# Altium schematic sheet [3] STM32F103 Debugger.SchDoc
size A3; Scale: 1:1; ENG_APP_DATE: --/--/--; DSN_APP_DATE: --/--/--; CHK_APP_DATE: --/--/--; Author: Vishal Y. Bajaj; SheetNumber: 3; SheetTotal: 11; Template: A3
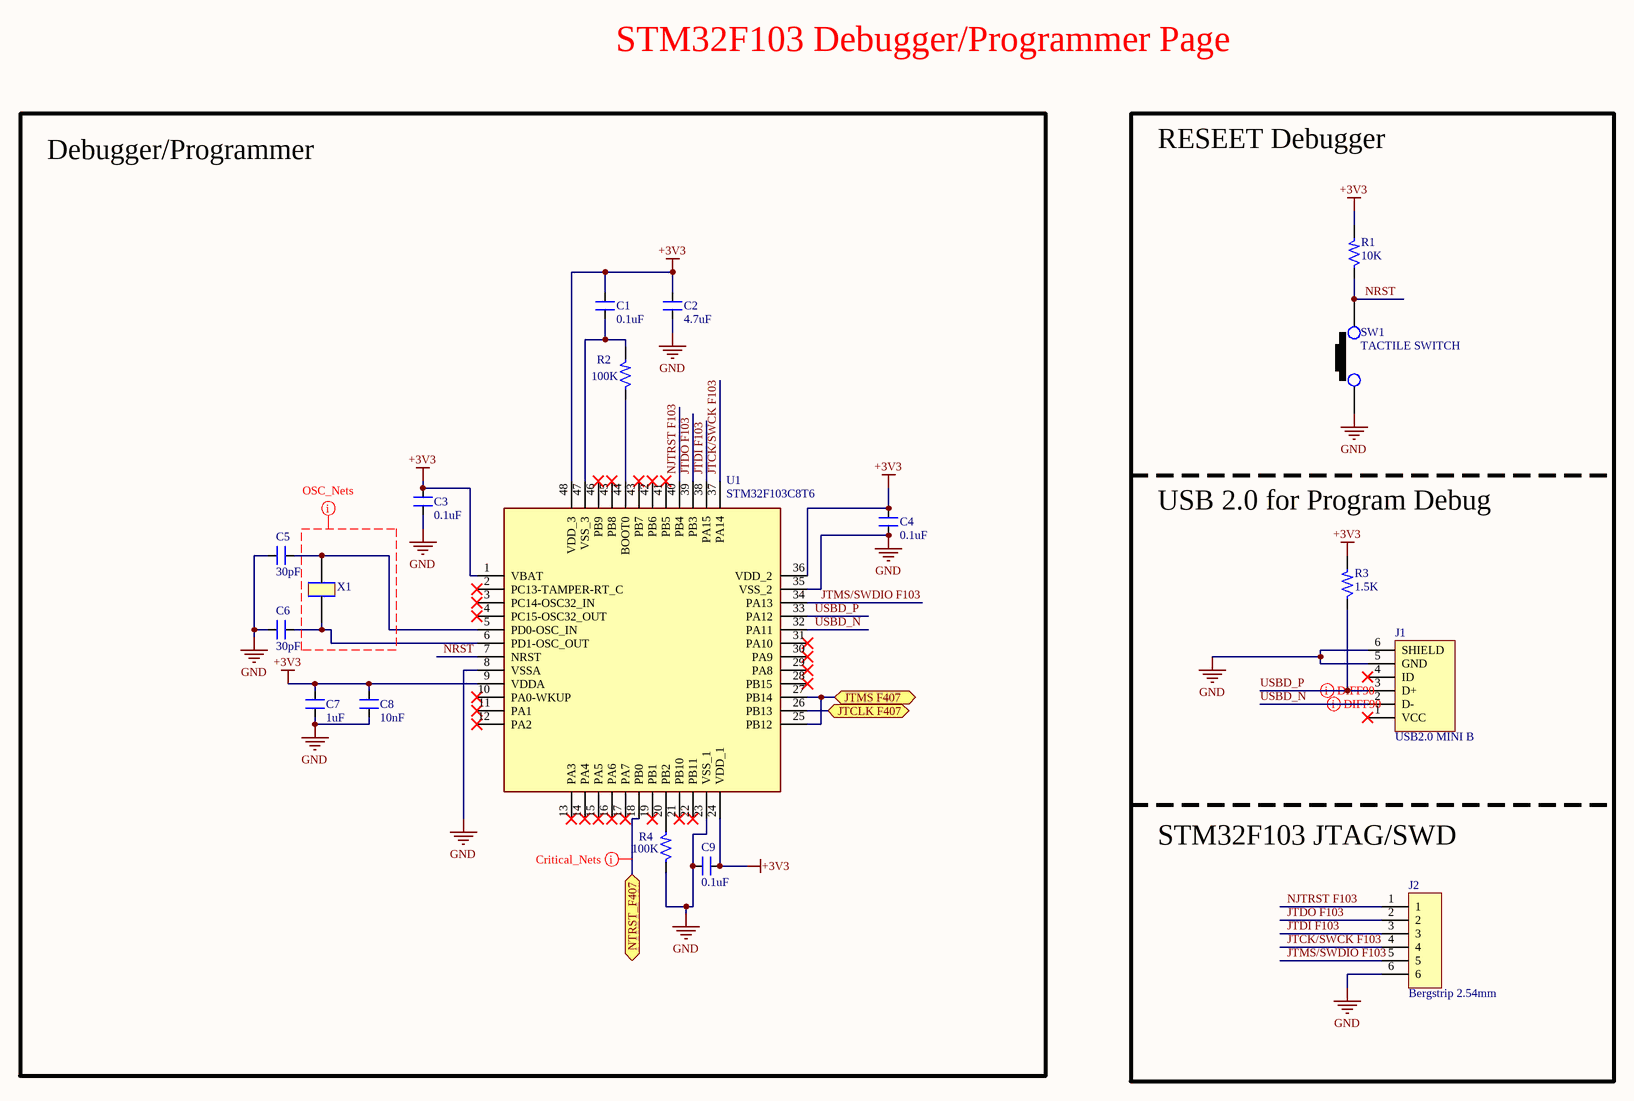
[diagram p0: [3] STM32F103 Debugger.SchDoc]

## Parts
C1  0.1uF  [CAP_0805]
C2  4.7uF  [CAP_0805]
C3  0.1uF  [CAP_0805]
C4  0.1uF  [CAP_0805]
C5  30pF  [CAP_0805]
C6  30pF  [CAP_0805]
C7  1uF  [CAP_0805]
C8  10nF  [CAP_0805]
C9  0.1uF  [CAP_0805]
J1  USB2.0 MINI B  [CON_690-005-299-043]
J2  Bergstrip 2.54mm  [CON6_100_59D78_TH_ST]
R1  10K  [RES_0603]
R2  100K  [RES_0603]
R3  1.5K  [RES_0805]
R4  100K  [RES_0603]
SW1  TACTILE SWITCH  [SW_342_SMD]
U1  STM32F103C8T6  [LQFP-48_19.6_393_58X11_SMD]
X1  (no value)  [XTAL_314_240X47_SMD]

## Blocks framed on the sheet
Debugger/Programmer: C1-C9 R2 R4 U1 X1

## Ports
JTCLK F407 (bidir), JTMS F407 (bidir), NTRST_F407 (bidir)

## Nets
+3V3: C1.2 C2.1 C3.2 C4.2 C7.2 C8.2 C9.1 R1.2 R3.2 U1.1(VBAT) U1.9(VDDA) U1.24(VDD_1) U1.36(VDD_2) U1.48(VDD_3)
GND: C2.2 C3.1 C4.1 C5.2 C6.2 C7.1 C8.1 C9.2 J1.5(GND) J1.6(SHIELD) J2.6 R4.1 SW1.1 U1.8(VSSA) U1.23(VSS_1) U1.35(VSS_2)
JTCK/SWCK F103: J2.4 U1.37(PA14)
JTCLK F407: U1.26(PB13) ; port JTCLK F407
JTDI F103: J2.3 U1.38(PA15)
JTDO F103: J2.2 U1.39(PB3)
JTMS F407: U1.25(PB12) U1.27(PB14) ; port JTMS F407
JTMS/SWDIO F103: J2.5 U1.34(PA13)
NJTRST F103: J2.1 U1.40(PB4)
NRST: R1.1 SW1.2 U1.7(NRST)
NTRST_F407: U1.18(PB0) ; port NTRST_F407
USBD_N: J1.2(D-) U1.32(PA11)
USBD_P: J1.3(D+) R3.1 U1.33(PA12)
NetC1_1: C1.1 R2.2 U1.47(VSS_3)
NetC5_1: C5.1 U1.5(PD0-OSC_IN) X1.2
NetC6_1: C6.1 U1.6(PD1-OSC_OUT) X1.1
NetR2_1: R2.1 U1.44(BOOT0)
NetR4_2: R4.2 U1.20(PB2)

Not connected (* = marked no-connect by the designer): J1 1(VCC)* 4(ID)*; U1 2(PC13-TAMPER-RT_C)* 3(PC14-OSC32_IN)* 4(PC15-OSC32_OUT)* 10(PA0-WKUP)* 11(PA1)* 12(PA2)* 13(PA3)* 14(PA4)* 15(PA5)* 16(PA6)* 17(PA7)* 19(PB1)* 21(PB10)* 22(PB11)* 28(PB15)* 29(PA8)* 30(PA9)* 31(PA10)* 41(PB5)* 42(PB6)* 43(PB7)* 45(PB8)* 46(PB9)*

## Layout directives
differential pair; differential pair class DIFF90: USBD_N, USBD_P
net class Critical_nets: NTRST_F407
net class OSC_Nets: (no net found under the mark)

## Notes on the sheet
- STM32F103 Debugger/Programmer Page
- RESEET Debugger
- (near R3) USB 2.0 for Program Debug
- (near J2) STM32F103 JTAG/SWD
- Project:
- Page Contents:
- Variant:
- Author:
- Scale:
- Template:
- Project Code:
- Sheet
- Date:
- of
- This documant is a copyright of Vishal Y. Bajaj and shall not be revealed, produced, copied in whole or in part nor used for any purpose
  other than submitted.

## Library data of the parts
C1 C3 C4 C9 = CAP_0.1uF-50V-10%-0805: 0.1µF ±10% 50V Ceramic Capacitor X7R 0805 (2012 Metric) /; Manufacturer: Samsung; Manufacturer Part Number: CL21B104KBCNNNC; Alternate Part Number-1: NA; Case/Package: 0805; Supplier-1: SIRICOM; Supplier Part Number-1: 0805B104K500CT
C2 = CAP_4.7uF-50V-10%-0805: 4.7µF ±10% 50V Ceramic Capacitor X5R 0805 (2012 Metric) /; Manufacturer: Yageo; Manufacturer Part Number: GRM21BR61H475KE51L; Alternate Part Number-1: NA; Case/Package: 0805; Supplier-1: SIRICOM; Supplier Part Number-1: CL21A475KBQNNNE
C5 C6 = CAP_30pF-50V-10%-0805: ±10% 50V Ceramic Capacitor C0G, NP0 0805 (2012 Metric) /; Manufacturer Part Number: C0805C300K5GAC7800; Manufacturer: KEMET; Alternate Part Number: NA; Case/Package: 0805; Supplier-1: Digikey; Supplier Part Number-1: 399-17443-1-ND - Cut Tape (CT)
C7 = CAP_1uF-50V-5%-0805: 1µF ±5% 50V Ceramic Capacitor X7R 0805 (2012 Metric) /; Manufacturer: Samsung; Manufacturer Part Number: CC0805JKX7R9BB105; Alternate Part Number-1: 0805F105M500NT; Case/Package: 0805; Supplier-1: SIRICOM; Supplier Part Number-1: CL21B105KBFNNNE
C8 = CAP_10nF-50V-10%-0805: 10000pF ±10% 50V Ceramic Capacitor X7R 0805 (2012 Metric) /; Manufacturer: Samsung; Manufacturer Part Number: C0805C103K5RECAUTO; Alternate Part Number-1: GRM2195C1H103JA01D; Case/Package: 0805; Supplier-1: SIRICOM; Supplier Part Number-1: 0805B103K500CT
J1 = CON_USB2.0-MINIB-SMD: USB - mini B USB 2.0 Receptacle Connector 5 Position Surface Mount, Right Angle; Manufacturer: EDAC; Manufacturer Part Number: 690-005-299-043; Alternate Part Number-1: NA; Case/Package: USB-MINI-B; Supplier-1: LCSC; Supplier Part Number-1: C105424
J2 = CON-BS-SKT_6X1-100-ST-TH: 6 Pins, 1 Row 2.54mm Pitch, Straight bergstrip, Female; Manufacturer: Molex; Alternate Part Number-1: NA; Manufacturer Part Number: 22-10-2061; Case/Package: TH-CON; Supplier-1: SP ROAD; Supplier Part Number-1: NA
R1 = RES_10K-0.1W-1%-0603: 10 kOhms ±1% 0.1W, 1/10W Chip Resistor 0603 (1608 Metric) Automotive AEC-Q200 Thick Film /; Manufacturer: Walsin; Manufacturer Part Number: WR06X1002FTL; Alternate Part Number-1: 0603WAJ0103T5E; Case/Package: 0603; Supplier-1: SIRICOM; Supplier Part Number-1: WR06X1002FTL
R2 R4 = RES_100K-0.1W-1%-0603: 100 kOhms ±1% 0.1W, 1/10W Chip Resistor 0603 (1608 Metric) Automotive AEC-Q200 Thick Film /; Manufacturer: Stackpole Electronics; Manufacturer Part Number: RMCF0603FT100K; Alternate Part Number-1: NA; Case/Package: 0603; Supplier-1: Arrow; Supplier Part Number-1: RMCF0603FT100K
R3 = RES_1.5K-0.125W-1%-0805: 1.5 kOhms ±1% 0.125W, 1/8W Chip Resistor 0805 (2012 Metric) Thick Film /; Manufacturer: TE Connectivity Passive Product; Manufacturer Part Number: CRG0805F1K5; Alternate Part Number-1: NA; Case/Package: 0805; Supplier-1: SIRICOM; Supplier Part Number-1: NA
SW1 = SW1_RS-282G05A3-SMRT-SMD: Tactile Switch SPST-NO Top Actuated Surface Mount; Manufacturer: ITT C&K; Alternate Part Number-1: NA; Manufacturer Part Number: RS-282G05A3-SMRT; Case/Package: SMD; Supplier-1: SP ROAD; Supplier Part Number-1: RS-282G05A3-SMRT
U1 = IC_STM32F103C8T6: ARM® Cortex®-M3 STM32F1 Microcontroller IC 32-Bit 72MHz 64KB (64K x 8) FLASH 48-LQFP (7x7) /; Manufacturer: STMicroelectronics; Alternate Part Number-1: NA; Manufacturer Part Number: STM32F103C8T6; Case/Package: LQFP48; Supplier-1: LCSC; Supplier Part Number-1: STM32F103C8T6
X1 = XTAL_8MHZ-ECS-80-32-5PX-SMD: 8MHz ±30ppm Crystal 32pF 60 Ohms HC-49/US /; Manufacturer: Fox Electronics; Manufacturer Part Number: ECS-80-32-5PX-TR; Alternate Part Number-1: NA; Case/Package: SMD/SMT; Supplier-1: SP ROAD; Supplier Part Number-1: ECS-80-32-5PX-TR